# Altium project EL6905_2023-07-04T10_27_02_UTC.PrjPcb (part 1 of 3)
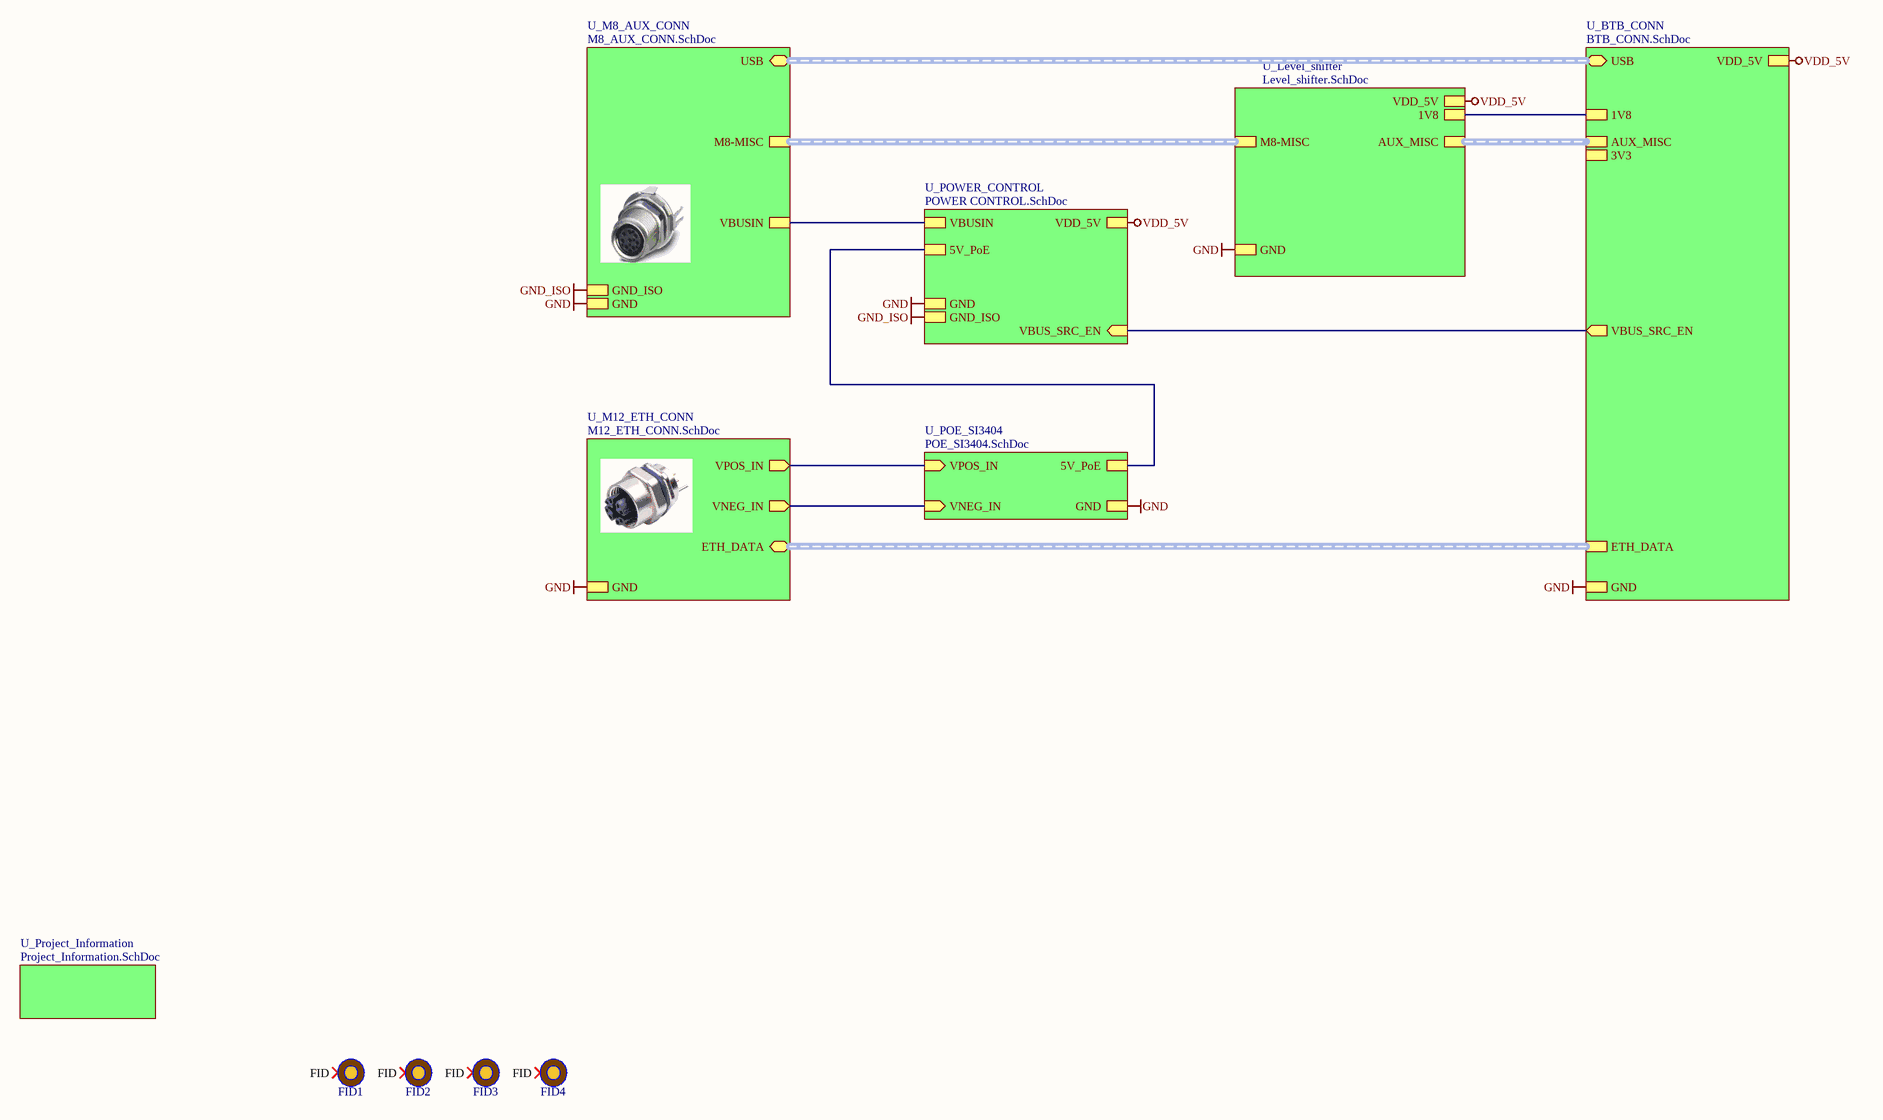
[diagram p0: TopLevel.SchDoc]
revision: R1M1E2; project_title: EL6905; drawn_by: Eason Lin; document_number: D2088000
8 sheets, 99 parts. Net scope: strictly hierarchical (ports join the sheet entries above them; power ports are local).
Board file: EL6905.PcbDoc
Sheets:
  TopLevel.SchDoc
    U_Project_Information = Project_Information.SchDoc
    U_M12_ETH_CONN = M12_ETH_CONN.SchDoc
    U_POE_SI3404 = POE_SI3404.SchDoc
    U_M8_AUX_CONN = M8_AUX_CONN.SchDoc
    U_BTB_CONN = BTB_CONN.SchDoc
    U_POWER_CONTROL = POWER CONTROL.SchDoc
    U_Level_shifter = Level_shifter.SchDoc

## Sheet TopLevel.SchDoc: =project_title
size Tabloid; CompanyName: Luxonis Holding; DrawnBy: Eason Lin; Organization: Luxonis Holding; Address1: 1925 Harmony Park Drive; Address2: Westminster, CO; Address3: 80234; Address4: United States; DocumentNumber: D2088000; Revision: R1M1E2; SheetNumber: 1; SheetTotal: 8

### Parts
FID1  FIDUCIAL_ROUND_1MM  [FIDUCIAL_ROUND_1MM]  (value not drawn)  (no BOM)
FID2  FIDUCIAL_ROUND_1MM  [FIDUCIAL_ROUND_1MM]  (value not drawn)  (no BOM)
FID3  FIDUCIAL_ROUND_1MM  [FIDUCIAL_ROUND_1MM]  (value not drawn)  (no BOM)
FID4  FIDUCIAL_ROUND_1MM  [FIDUCIAL_ROUND_1MM]  (value not drawn)  (no BOM)

### Sub-sheets
U_BTB_CONN = BTB_CONN.SchDoc: GND, ETH_DATA (harness ETH_DATA), VDD_5V, 1V8, USB (bidir, harness USB), 3V3, AUX_MISC (harness AUX_MISC), VBUS_SRC_EN (out)
U_Level_shifter = Level_shifter.SchDoc: VDD_5V, 1V8, GND, AUX_MISC (harness AUX_MISC), M8-MISC (harness M8-MISC)
U_M8_AUX_CONN = M8_AUX_CONN.SchDoc: GND, VBUSIN, USB (bidir, harness USB), GND_ISO, M8-MISC (harness M8-MISC)
U_M12_ETH_CONN = M12_ETH_CONN.SchDoc: VPOS_IN (out), VNEG_IN (out), ETH_DATA (bidir, harness ETH_DATA), GND
U_POE_SI3404 = POE_SI3404.SchDoc: 5V_PoE, GND, VPOS_IN (in), VNEG_IN (in)
U_POWER_CONTROL = POWER CONTROL.SchDoc: VDD_5V, GND_ISO, GND, 5V_PoE, VBUSIN, VBUS_SRC_EN (in)
U_Project_Information = Project_Information.SchDoc: no entries

### Nets
1V8: sheet U_BTB_CONN/1V8, sheet U_Level_shifter/1V8
5V_PoE: sheet U_POE_SI3404/5V_PoE, sheet U_POWER_CONTROL/5V_PoE
GND: sheet U_M12_ETH_CONN/GND, sheet U_POE_SI3404/GND, sheet U_M8_AUX_CONN/GND, sheet U_BTB_CONN/GND, sheet U_POWER_CONTROL/GND, sheet U_Level_shifter/GND
GND_ISO: sheet U_M8_AUX_CONN/GND_ISO, sheet U_POWER_CONTROL/GND_ISO
VBUSIN: sheet U_M8_AUX_CONN/VBUSIN, sheet U_POWER_CONTROL/VBUSIN
VDD_5V: sheet U_BTB_CONN/VDD_5V, sheet U_POWER_CONTROL/VDD_5V, sheet U_Level_shifter/VDD_5V
VNEG_IN: sheet U_M12_ETH_CONN/VNEG_IN, sheet U_POE_SI3404/VNEG_IN
VBUS_SRC_EN_1V8: sheet U_BTB_CONN/VBUS_SRC_EN, sheet U_POWER_CONTROL/VBUS_SRC_EN
VPOS_IN: sheet U_M12_ETH_CONN/VPOS_IN, sheet U_POE_SI3404/VPOS_IN

Not connected (* = marked no-connect by the designer): FID1 FID*; FID2 FID*; FID3 FID*; FID4 FID*

### Buses and harness runs
harness sheet U_BTB_CONN/AUX_MISC = sheet U_Level_shifter/AUX_MISC
harness sheet U_BTB_CONN/ETH_DATA = sheet U_M12_ETH_CONN/ETH_DATA
harness sheet U_BTB_CONN/USB = sheet U_M8_AUX_CONN/USB
harness sheet U_Level_shifter/M8-MISC = sheet U_M8_AUX_CONN/M8-MISC

### Notes on the sheet
- Title
- Size:
- Date:
- Tabloid
- Number:
- Time:
- Revision:
- Sheet
- of
- Drawn by:

### Library data of the parts
FID1-FID4 = FIDUCIAL: Fiducial with various available footprints

## Sheet Project_Information.SchDoc: =project_title
size Tabloid; CompanyName: Luxonis Holding; DrawnBy: Eason Lin; Organization: Luxonis Holding; Address1: 1925 Harmony Park Drive; Address2: Westminster, CO; Address3: 80234; Address4: United States; DocumentNumber: D2088000; Revision: R1M1E2; SheetNumber: 2; SheetTotal: 8
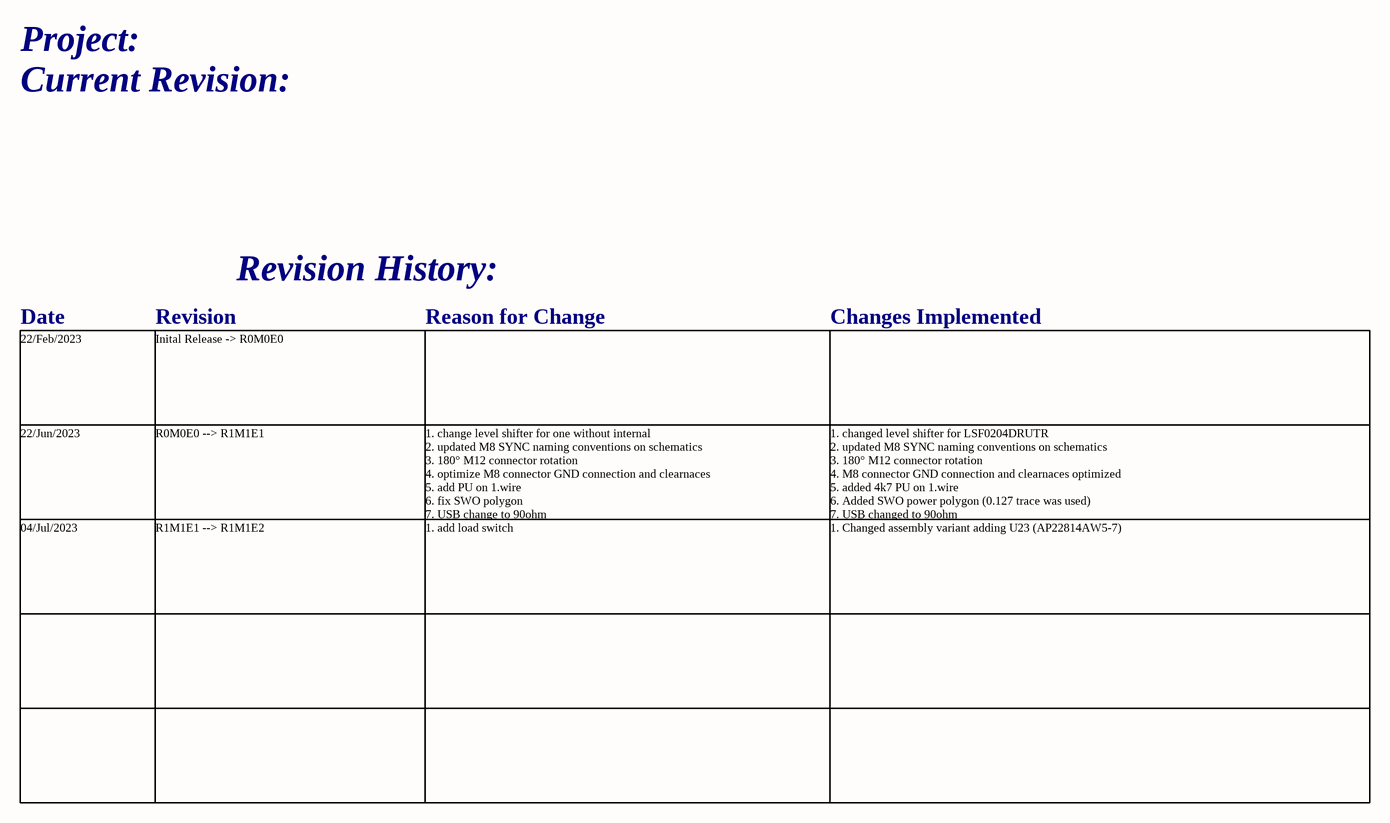
[diagram p1: Project_Information.SchDoc]

### Notes on the sheet
- Project:
- Current Revision:
- Revision History:
- Date
- Revision
- Reason for Change
- Changes Implemented
- 22/Feb/2023
- Inital Release -> R0M0E0
- 22/Jun/2023
- R0M0E0 --> R1M1E1
- 1. change level shifter for one without internal
  2. updated M8 SYNC naming conventions on schematics
  3. 180° M12 connector rotation
  4. optimize M8 connector GND connection and clearnaces
  5. add PU on 1.wire
  6. fix SWO polygon
  7. USB change to 90ohm
- 1. changed level shifter for LSF0204DRUTR
  2. updated M8 SYNC naming conventions on schematics
  3. 180° M12 connector rotation
  4. M8 connector GND connection and clearnaces optimized
  5. added 4k7 PU on 1.wire
  6. Added SWO power polygon (0.127 trace was used)
  7. USB changed to 90ohm
- 04/Jul/2023
- R1M1E1 --> R1M1E2
- 1. add load switch
- 1. Changed assembly variant adding U23 (AP22814AW5-7)
- Title
- Size:
- Date:
- Tabloid
- Number:
- Time:
- Revision:
- Sheet
- of
- Drawn by:

## Sheet M12_ETH_CONN.SchDoc: =project_title
size Tabloid; CompanyName: Luxonis Holding; DrawnBy: Eason Lin; Organization: Luxonis Holding; Address1: 1925 Harmony Park Drive; Address2: Westminster, CO; Address3: 80234; Address4: United States; DocumentNumber: D2088000; Revision: R1M1E2; SheetNumber: 6; SheetTotal: 8
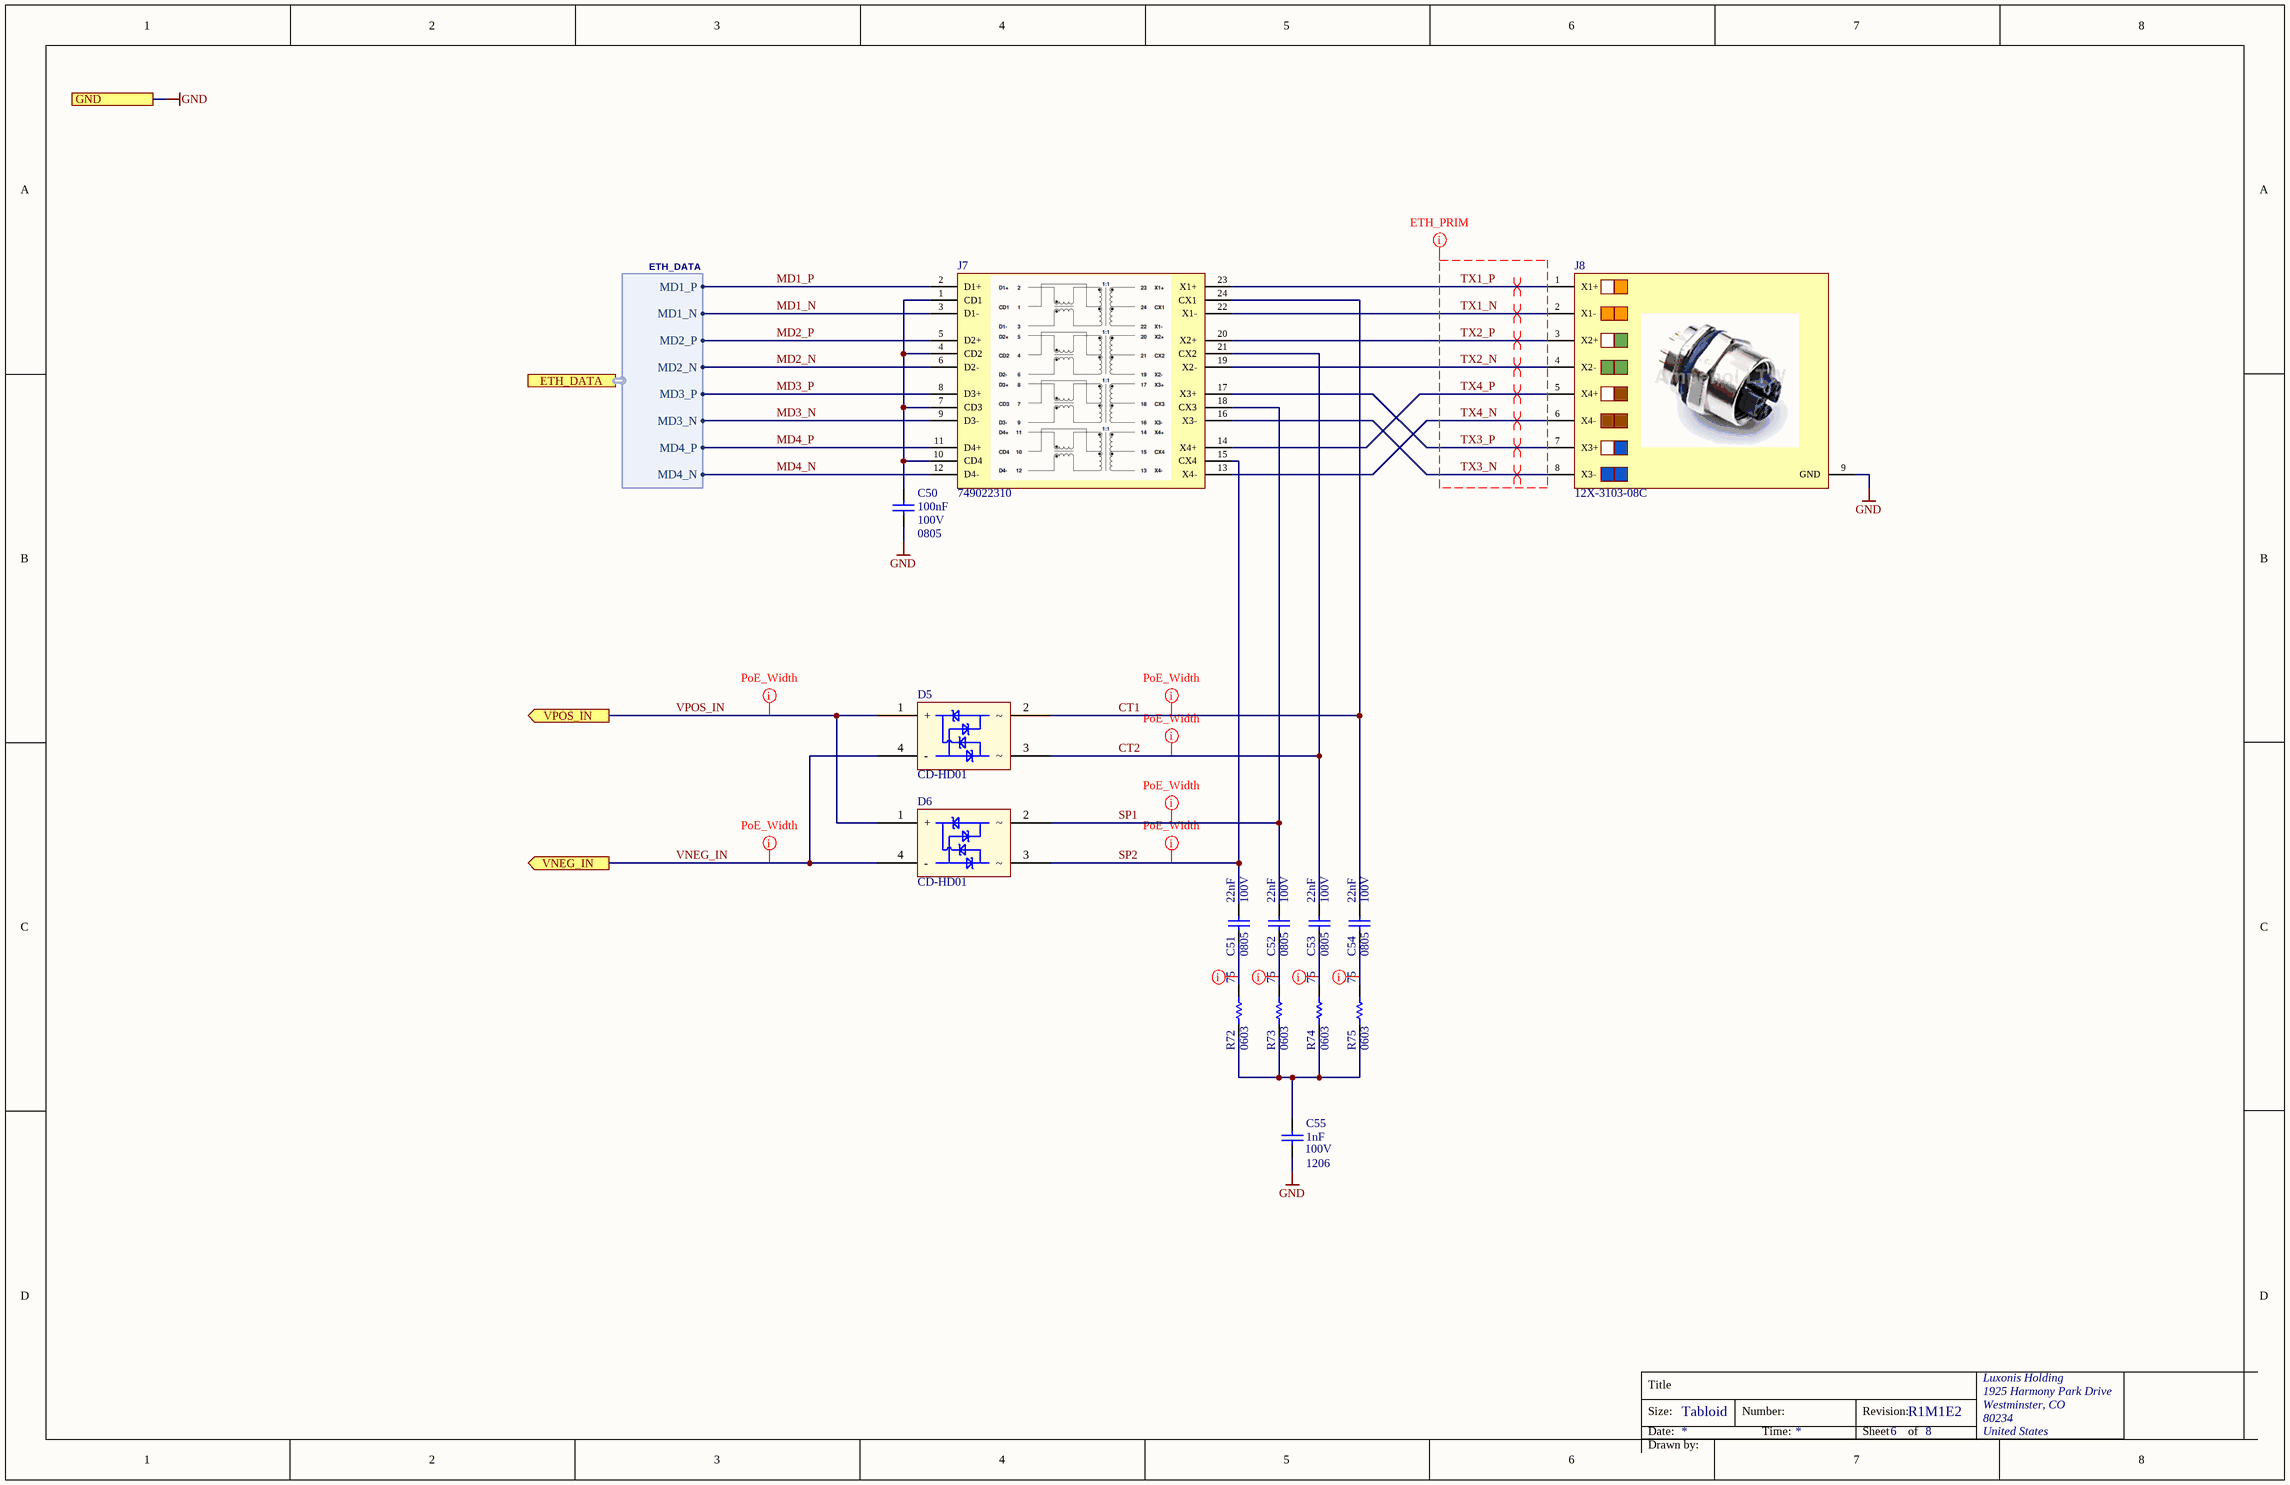
[diagram p2: M12_ETH_CONN.SchDoc]

### Parts
C50  value 100nF  Voltage Rating: 100V  Case/Package: 0805  [CAPC0805(2012)145_N]  (hidden comment: CL21B104KCFNNNE)
C51  value 22nF  Voltage Rating: 100V  Case/Package: 0805  [CAPC0805(2012)145_L]  (hidden comment: C0805C223M1RACAUTO)
C52  value 22nF  Voltage Rating: 100V  Case/Package: 0805  [CAPC0805(2012)145_L]  (hidden comment: C0805C223M1RACAUTO)
C53  value 22nF  Voltage Rating: 100V  Case/Package: 0805  [CAPC0805(2012)145_L]  (hidden comment: C0805C223M1RACAUTO)
C54  value 22nF  Voltage Rating: 100V  Case/Package: 0805  [CAPC0805(2012)145_L]  (hidden comment: C0805C223M1RACAUTO)
C55  value 1nF  Voltage Rating: 100V  Case/Package: 1206  [CAPC1206(3216)130_L]  (hidden comment: C1206C102KGRACTU)
D5  CD-HD01  [CD-H01]
D6  CD-HD01  [CD-H01]
J7  749022310  [749022310]
J8  12X-3103-08C  [12X-3103-08C]
R72  value 75  Case/Package: 0603  [RESC0603(1608)_N]  (hidden comment: ERJ-UP3F75R0V)
R73  value 75  Case/Package: 0603  [RESC0603(1608)_N]  (hidden comment: ERJ-UP3F75R0V)
R74  value 75  Case/Package: 0603  [RESC0603(1608)_N]  (hidden comment: ERJ-UP3F75R0V)
R75  value 75  Case/Package: 0603  [RESC0603(1608)_N]  (hidden comment: ERJ-UP3F75R0V)

### Ports
ETH_DATA (harness ETH_DATA), GND, VNEG_IN (out), VPOS_IN (out)

### Harnesses
ETH_DATA: MD1_P, MD1_N, MD2_P, MD2_N, MD3_P, MD3_N, MD4_P, MD4_N

### Nets
GND: C50.1 C55.1 J8.9(GND) ; port GND
VNEG_IN: D5.4(-) D6.4(-) ; port VNEG_IN
CT1: C54.2 D5.2 J7.24(CX1)
CT2: C53.2 D5.3 J7.21(CX2)
MD1_N: J7.3(D1-) ; port ETH_DATA.MD1_N
MD1_P: J7.2(D1+) ; port ETH_DATA.MD1_P
MD2_N: J7.6(D2-) ; port ETH_DATA.MD2_N
MD2_P: J7.5(D2+) ; port ETH_DATA.MD2_P
MD3_N: J7.9(D3-) ; port ETH_DATA.MD3_N
MD3_P: J7.8(D3+) ; port ETH_DATA.MD3_P
MD4_N: J7.12(D4-) ; port ETH_DATA.MD4_N
MD4_P: J7.11(D4+) ; port ETH_DATA.MD4_P
SP1: C52.2 D6.2 J7.18(CX3)
SP2: C51.2 D6.3 J7.15(CX4)
TX1_N: J7.22(X1-) J8.2(X1-)
TX1_P: J7.23(X1+) J8.1(X1+)
TX2_N: J7.19(X2-) J8.4(X2-)
TX2_P: J7.20(X2+) J8.3(X2+)
TX3_N: J7.16(X3-) J8.8(X3-)
TX3_P: J7.17(X3+) J8.7(X3+)
TX4_N: J7.13(X4-) J8.6(X4-)
TX4_P: J7.14(X4+) J8.5(X4+)
VPOS_IN: D5.1(+) D6.1(+) ; port VPOS_IN
NetC50_2: C50.2 J7.1(CD1) J7.4(CD2) J7.7(CD3) J7.10(CD4)
NetC51_1: C51.1 R72.2
NetC52_1: C52.1 R73.2
NetC53_1: C53.1 R74.2
NetC54_1: C54.1 R75.2
NetC55_2: C55.2 R72.1 R73.1 R74.1 R75.1

### Layout directives
differential pair; differential pair class 100ohm: TX1_N, TX1_P, TX2_N, TX2_P, TX3_N, TX3_P, TX4_N, TX4_P
rule Width Constraint [Pref Width = 15mil    Min Width = 4mil    Max Width = 50mil]; net class PoE: CT1, CT2, NetC51_1, NetC52_1, NetC53_1, NetC54_1, SP1, SP2, VNEG_IN, VPOS_IN
net class ETH_PRIM: TX1_N, TX1_P, TX2_N, TX2_P, TX3_N, TX3_P, TX4_N, TX4_P

### Notes on the sheet
- Title
- Size:
- Date:
- Tabloid
- Number:
- Time:
- Revision:
- Sheet
- of
- Drawn by:

### Library data of the parts
C50 = CMP-108-000003-5: CAP CER 0.1UF 100V X7R 0805 10%; Manufacturer 1: Samsung; Dielectric: X7R; Manufacturer Part Number 1: CL21B104KCFNNNE; Length: 2mm; Width: 0.049inch; Max Operating Temperature: 125°C; Mounting Technology: SMT; ComponentLink1Description: https://datasheet.ciiva.com/26936/getdatasheetpartid-781823-26936904.pdf?src-supplier=Verical; Depth: 1.25mm; Min Operating Temperature: -55°C; ComponentLink1URL: https://datasheet.ciiva.com/26936/getdatasheetpartid-781823-26936904.pdf?src-supplier=Verical; Design Item ID: CL21B104KCFNNNE; Tolerance: 10%
C51-C54 = CMP-004-000002-5: CAP CER 22nF 100V X7R 0805 20%; Manufacturer 1: KEMET; Capacitor Type: Ceramic; ComponentLink2URL: http://components.arrow.com/part/dataview/0323_00327945?src-supplier=Arrow+Europe; Manufacturer Part Number 1: C0805C223M1RACAUTO; ComponentLink2Description: http://components.arrow.com/part/dataview/0323_00327945?src-supplier=Arrow+Europe; ComponentLink5URL: https://api.kemet.com/component-edge/download/datasheet/C0805C223M1RACAUTO.pdf?src-supplier=Digi-Key; Min Operating Temperature: -55°C; Width: 1.25mm; Height: 0.9mm; Design Item ID: C0805C223M1RACAUTO; Tolerance: 20%; ComponentLink4Description: http://www.kemet.com/docfinder?Partnumber=C0805C223M1RACAUTO&src-supplier=Digi-Key; Dielectric: X7R; ComponentLink5Description: https://api.kemet.com/component-edge/download/datasheet/C0805C223M1RACAUTO.pdf?src-supplier=Digi-Key; ComponentLink3Description: http://capacitoredge.kemet.com/capedge2/DataSheet/Datasheet-C0805C223M1RACAUTO.pdf?pn=C0805C223M1RACAUTO&src-supplier=Avnet; ComponentLink4URL: http://www.kemet.com/docfinder?Partnumber=C0805C223M1RACAUTO&src-supplier=Digi-Key; Mounting Technology: SMT; ComponentLink3URL: http://capacitoredge.kemet.com/capedge2/DataSheet/Datasheet-C0805C223M1RACAUTO.pdf?pn=C0805C223M1RACAUTO&src-supplier=Avnet; ComponentLink1URL: https://datasheet.ciiva.com:443/pdfs/VipMasterIC/IC/KEME/KEME-S-A0009891634/KEME-S-A0009891634-1.pdf?src-supplier=IHS+Markit; ComponentLink1Description: https://datasheet.ciiva.com:443/pdfs/VipMasterIC/IC/KEME/KEME-S-A0009891634/KEME-S-A0009891634-1.pdf?src-supplier=IHS+Markit; Length: 2mm; Max Operating Temperature: 125°C
C55 = CMP-004-000001-5: CAP CER 1nF 2000V X7R 1206 10%; Manufacturer 1: KEMET; Capacitor Type: Ceramic; Manufacturer Part Number 1: C1206C102KGRACTU; Min Operating Temperature: -55°C; Height: 1.6mm; ComponentLink2URL: https://datasheet.ciiva.com/18194/getdatasheetpartid-359031-18194095.pdf?src-supplier=Verical; ComponentLink4URL: https://datasheet.ciiva.com/28672/1807957-28672854.pdf?src-supplier=Element14; ComponentLink1Description: https://datasheet.ciiva.com:443/pdfs/VipMasterIC/IC/KEME/KEME-S-A0007617657/KEME-S-A0007567533-1.pdf?src-supplier=IHS+Markit; ComponentLink2Description: https://datasheet.ciiva.com/18194/getdatasheetpartid-359031-18194095.pdf?src-supplier=Verical; Dielectric: X7R; Width: 1.6mm; Length: 3.2mm; ComponentLink1URL: https://datasheet.ciiva.com:443/pdfs/VipMasterIC/IC/KEME/KEME-S-A0007617657/KEME-S-A0007567533-1.pdf?src-supplier=IHS+Markit; Design Item ID: C1206C102KGRACTU; ComponentLink3Description: https://datasheet.ciiva.com/28610/1372242-28610895.pdf?src-supplier=Element14; Max Operating Temperature: 125°C; ComponentLink4Description: https://datasheet.ciiva.com/28672/1807957-28672854.pdf?src-supplier=Element14; ComponentLink3URL: https://datasheet.ciiva.com/28610/1372242-28610895.pdf?src-supplier=Element14; Mounting Technology: SMT; Tolerance: 10%
D5 D6 = CMP-004-00050-1: CD-HD0x Series Schottky Bridge Rectifier Diode 100V 4-Pin Surface Mount T/R; Manufacturer 1: Bourns; Average Rectified Current: 1A; Source: NG9097_test.SchLib; RoHS: No; Pricing 1: 1=0.61000, 10=0.52500, 100=0.36400, 500=0.28420, 1000=0.23100, 2000=0.21700 (USD); Packaging: Tape and Reel; Mount: Surface Mount; Design Item ID: CD-HD01; Stock 1: 15383; Min Operating Temperature: -55°C; Manufacturer Part Number 1: CD-HD01; Max Operating Temperature: 125°C
J7 = CMP-012-00001-3: WE-LAN AQ SMT Transformer, 1000 Base-T, PoE+ (up to 720 mA), 150uH; Manufacturer 1: Wurth Elektronik; Manufacturer Part Number 1: 749022310; Design Item ID: 749022310
J8 = CMP-002-00115-2: Conn M12 Circular F 8 POS Solder ST Thru-Hole 8 Terminal 1 Port; Manufacturer 1: KingTop; Stock 1: 703; ComponentLink1URL: http://www.farnell.com/datasheets/1945922.pdf?src-supplier=Element14; ComponentLink1Description: http://www.farnell.com/datasheets/1945922.pdf?src-supplier=Element14; Source: NG9097.SchLib; Manufacturer Part Number 1: 12X-3103-08C; Pins: 8; Pricing 1: 1=10,44000, 10=9,39800, 25=8,85280, 50=8,62600, 100=8,39900, 250=7,49100, 500=7,03700, 1000=6,35600 (USD); RoHS: No; Design Item ID: 12X-3103-08C; ComponentLink2Description: http://www.farnell.com/datasheets/1879376.pdf?src-supplier=Element14; ComponentLink2URL: http://www.farnell.com/datasheets/1879376.pdf?src-supplier=Element14; Category: Circular Connectors
R72-R75 = CMP-013-000003-8: RES SMD 75 OHM 150V 1% 1/10W 0603; Manufacturer 1: Panasonic; Manufacturer Part Number 1: ERJ-UP3F75R0V; Design Item ID: ERJ-UP3F75R0V

## Sheet POE_SI3404.SchDoc: =project_title
size Tabloid; CompanyName: Luxonis Holding; DrawnBy: Eason Lin; Organization: Luxonis Holding; Address1: 1925 Harmony Park Drive; Address2: Westminster, CO; Address3: 80234; Address4: United States; DocumentNumber: D2088000; Revision: R1M1E2; SheetNumber: 5; SheetTotal: 8
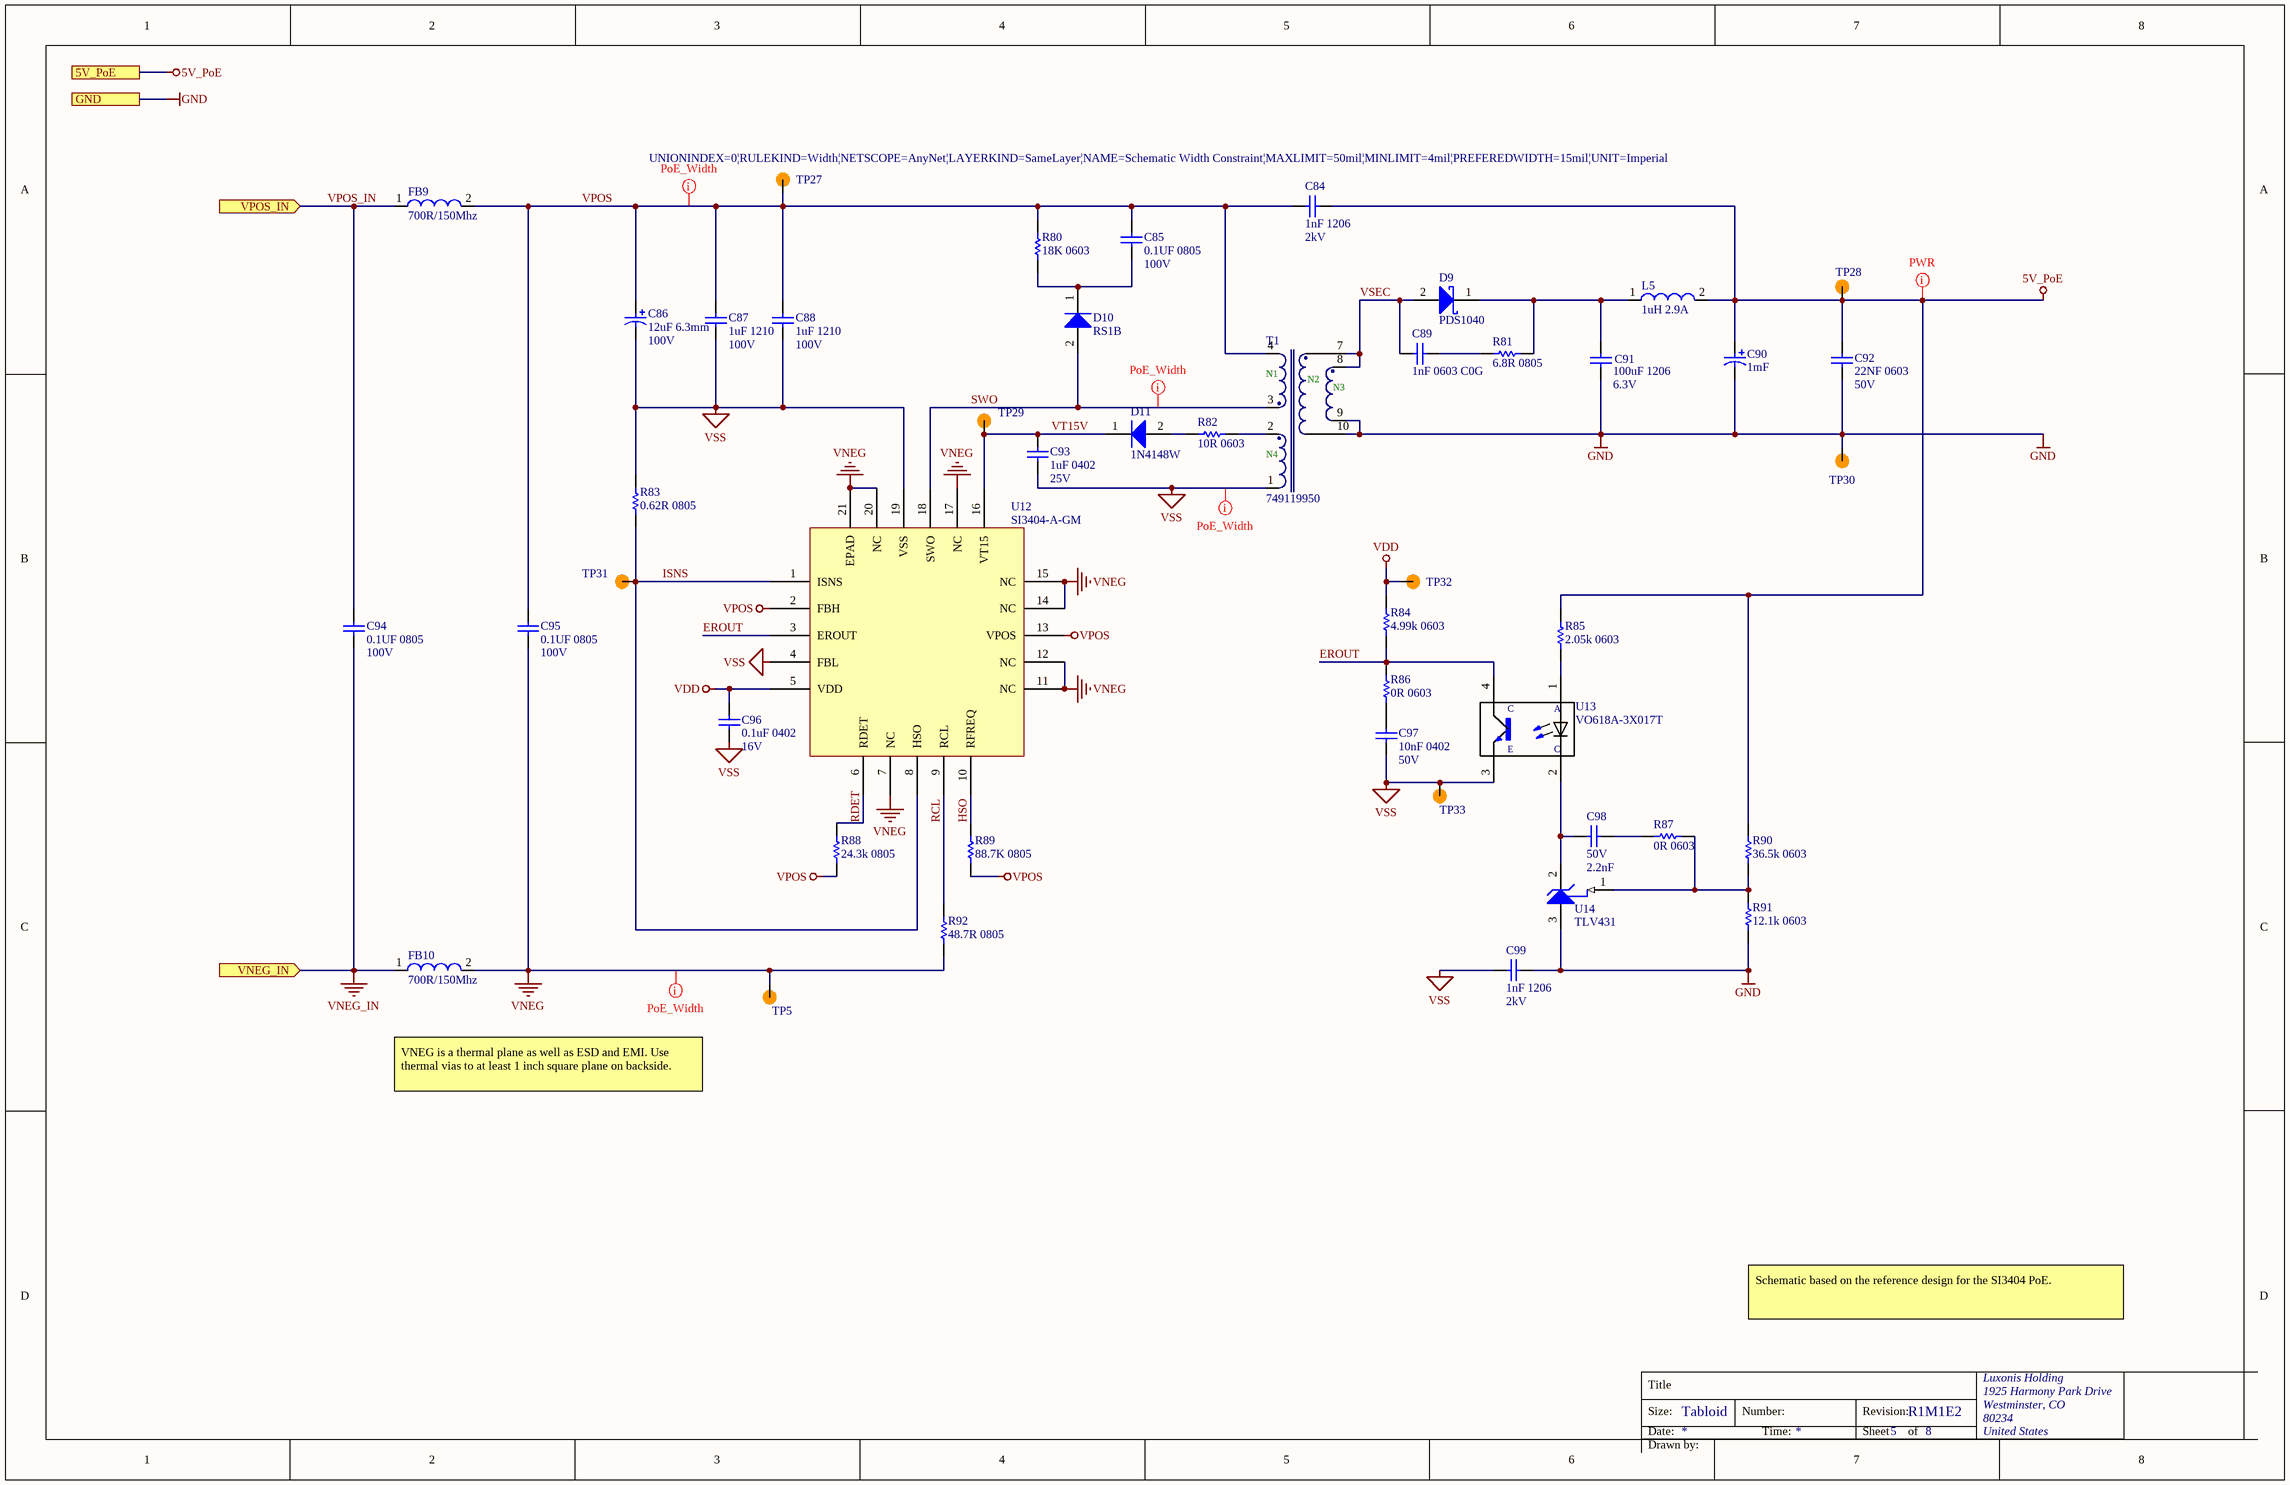
[diagram p3: POE_SI3404.SchDoc]

### Parts
C84  1nF 1206  Voltage Rating (DC): 2kV  [CAPC1206(3216)190_N]
C85  0.1UF 0805  Voltage Rating: 100V  [CAPC0805(2012)145_N]
C86  12uF 6.3mm  Voltage: 100V  [EEU-FC2A120]
C87  1uF 1210  Voltage Rating: 100V  [CAPC1210(3225)280_N]
C88  1uF 1210  Voltage Rating: 100V  [CAPC1210(3225)280_N]
C89  1nF 0603 C0G  [CAPC0603(1608)100_N]
C90  value 1mF  [ECA-0JM102]  (hidden comment: ECA-0JM102)
C91  100uF 1206  Voltage: 6.3V  [CAPC1206(3216)190_N]
C92  22NF 0603  Voltage: 50V  [CAPC0603(1608)100_N]
C93  1uF 0402  Voltage Rating: 25V  [CAPC0402(1005)70_N]
C94  0.1UF 0805  Voltage Rating: 100V  [CAPC0805(2012)145_N]
C95  0.1UF 0805  Voltage Rating: 100V  [CAPC0805(2012)145_N]
C96  0.1uF 0402  Voltage Rating: 16V  [CAPC0402(1005)60_N]
C97  10nF 0402  Voltage Rating: 50V  [CAPC0402(1005)60_N]
C98  value 2.2nF  Voltage Rating: 50V  [CAPC0603(1608)100_N]  (hidden comment: GRM1885C1H222JA01D)
C99  1nF 1206  Voltage Rating (DC): 2kV  [CAPC1206(3216)190_N]
D9  PDS1040  [PDS1040-13]
D10  RS1B  [RS1B]
D11  1N4148W  [1N4148W-7-F]
FB9  700R/150Mhz  [742792040]
FB10  700R/150Mhz  [742792040]
L5  1uH 2.9A  [DO1608C-102MLx]
R80  18K 0603  [RESC0603(1608)_N]
R81  6.8R 0805  [RESC0805(2012)_N]
R82  10R 0603  [RESC0603(1608)_N]
R83  0.62R 0805  [RESC0805(2012)_N]
R84  4.99k 0603  [RESC0603(1608)_N]
R85  2.05k 0603  [RESC0603(1608)_N]
R86  0R 0603  [RESC0603(1608)_N]
R87  0R 0603  [RESC0603(1608)_N]
R88  24.3k 0805  [RESC0805(2012)_N]
R89  88.7K 0805  [RESC0805(2012)_N]
R90  36.5k 0603  [RESC0603(1608)_N]
R91  12.1k 0603  [RESC0603(1608)_N]
R92  48.7R 0805  [RESC0805(2012)_N]
T1  749119950  [749119950]
TP5  TP100_200_NS  [TP075_150_NS]  (value not drawn)  (no BOM)
TP27  TP100_200_NS  [TP075_150_NS]  (value not drawn)  (no BOM)
TP28  TP100_200_NS  [TP075_150_NS]  (value not drawn)  (no BOM)
TP29  TP100_200_NS  [TP075_150_NS]  (value not drawn)  (no BOM)
TP30  TP100_200_NS  [TP075_150_NS]  (value not drawn)  (no BOM)
TP31  TP100_200_NS  [TP075_150_NS]  (value not drawn)  (no BOM)
TP32  TP100_200_NS  [TP075_150_NS]  (value not drawn)  (no BOM)
TP33  TP100_200_NS  [TP075_150_NS]  (value not drawn)  (no BOM)
U12  SI3404-A-GM  [Si3404-A-GM]
U13  VO618A-3X017T  [VO618A-3X017T]
U14  TLV431  [TLV431BCDBZR]

### Ports
5V_PoE, GND, VNEG_IN (in), VPOS_IN (in)

### Nets
5V_PoE: C84.2 C90.1 C92.2 L5.2 R85.2 R90.2 TP28.1 ; port 5V_PoE
GND: C90.2 C91.1 C92.1 C99.2 R91.1 T1.9 T1.10 TP30.1 U14.3(ANODE) ; port GND
VDD: C96.2 R84.2 TP32.1 U12.5(VDD)
VNEG: C95.1 FB10.2 R92.1 TP5.1 U12.7(NC) U12.11(NC) U12.12(NC) U12.14(NC) U12.15(NC) U12.17(NC) U12.20(NC) U12.21(EPAD)
VNEG_IN: C94.1 FB10.1 ; port VNEG_IN
VPOS: C84.1 C85.2 C86.1 C87.2 C88.2 C95.2 FB9.2 R80.2 R88.1 R89.1 T1.4 TP27.1 U12.2(FBH) U12.13(VPOS)
VSS: C86.2 C87.1 C88.1 C93.1 C96.1 C97.1 C99.1 R83.2 T1.1 TP33.1 U12.4(FBL) U12.19(VSS) U13.3(E)
EROUT: R84.1 R86.2 U12.3(EROUT) U13.4(CO)
HSO: R89.2 U12.10(RFREQ)
ISNS: R83.1 TP31.1 U12.1(ISNS) U12.8(HSO)
RCL: R92.2 U12.9(RCL)
RDET: R88.2 U12.6(RDET)
SWO: D10.2(A) T1.3 U12.18(SWO)
VPOS_IN: C94.2 FB9.1 ; port VPOS_IN
VSEC: C89.2 D9.2(A) T1.7 T1.8
VT15V: C93.2 D11.1(K) TP29.1 U12.16(VT15)
NetC85_1: C85.1 D10.1(K) R80.1
NetC89_1: C89.1 R81.1
NetC91_2: C91.2 D9.1(K) L5.1 R81.2
NetC97_2: C97.2 R86.1
NetC98_1: C98.1 U13.2(C) U14.2(CATHODE)
NetC98_2: C98.2 R87.2
NetD11_2: D11.2(A) R82.1
NetR82_2: R82.2 T1.2
NetR85_1: R85.1 U13.1(A)
NetR87_1: R87.1 R90.1 R91.2 U14.1(REF)

### Layout directives
rule Width Constraint [Pref Width = 15mil    Min Width = 4mil    Max Width = 50mil]; net class PoE: SWO, VNEG, VPOS, VSS
net class PWR; Current Rating: 3A: 5V_PoE

### Notes on the sheet
- VNEG is a thermal plane as well as ESD and EMI. Use thermal vias to at least 1 inch square plane on backside.
- Schematic based on the reference design for the SI3404 PoE.
- Title
- Size:
- Date:
- Tabloid
- Number:
- Time:
- Revision:
- Sheet
- of
- Drawn by:
- (in symbol 749119950) N1; N2; N3; N4